# EAGLE schematic PCB 1.5 TH (EAGLE 6.5.0)
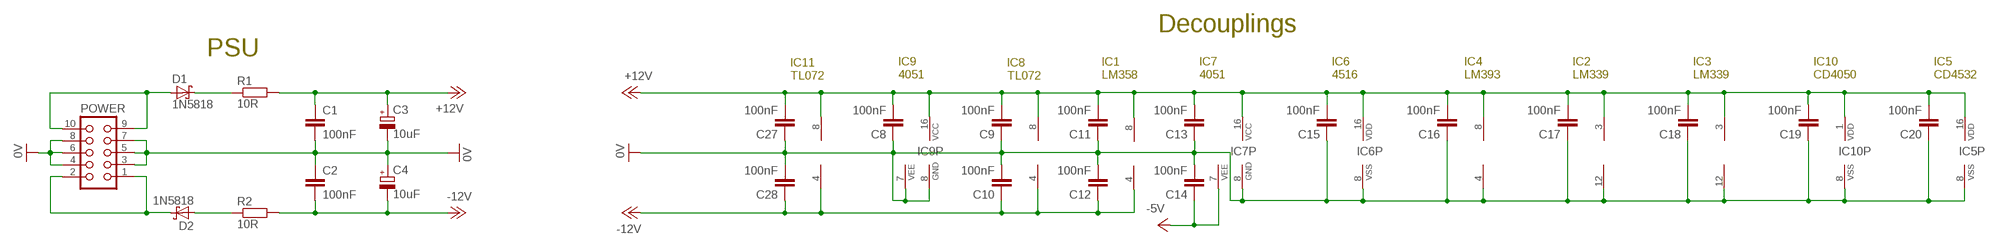
[diagram p0: schematic, sheet 1, part 1 of 2]
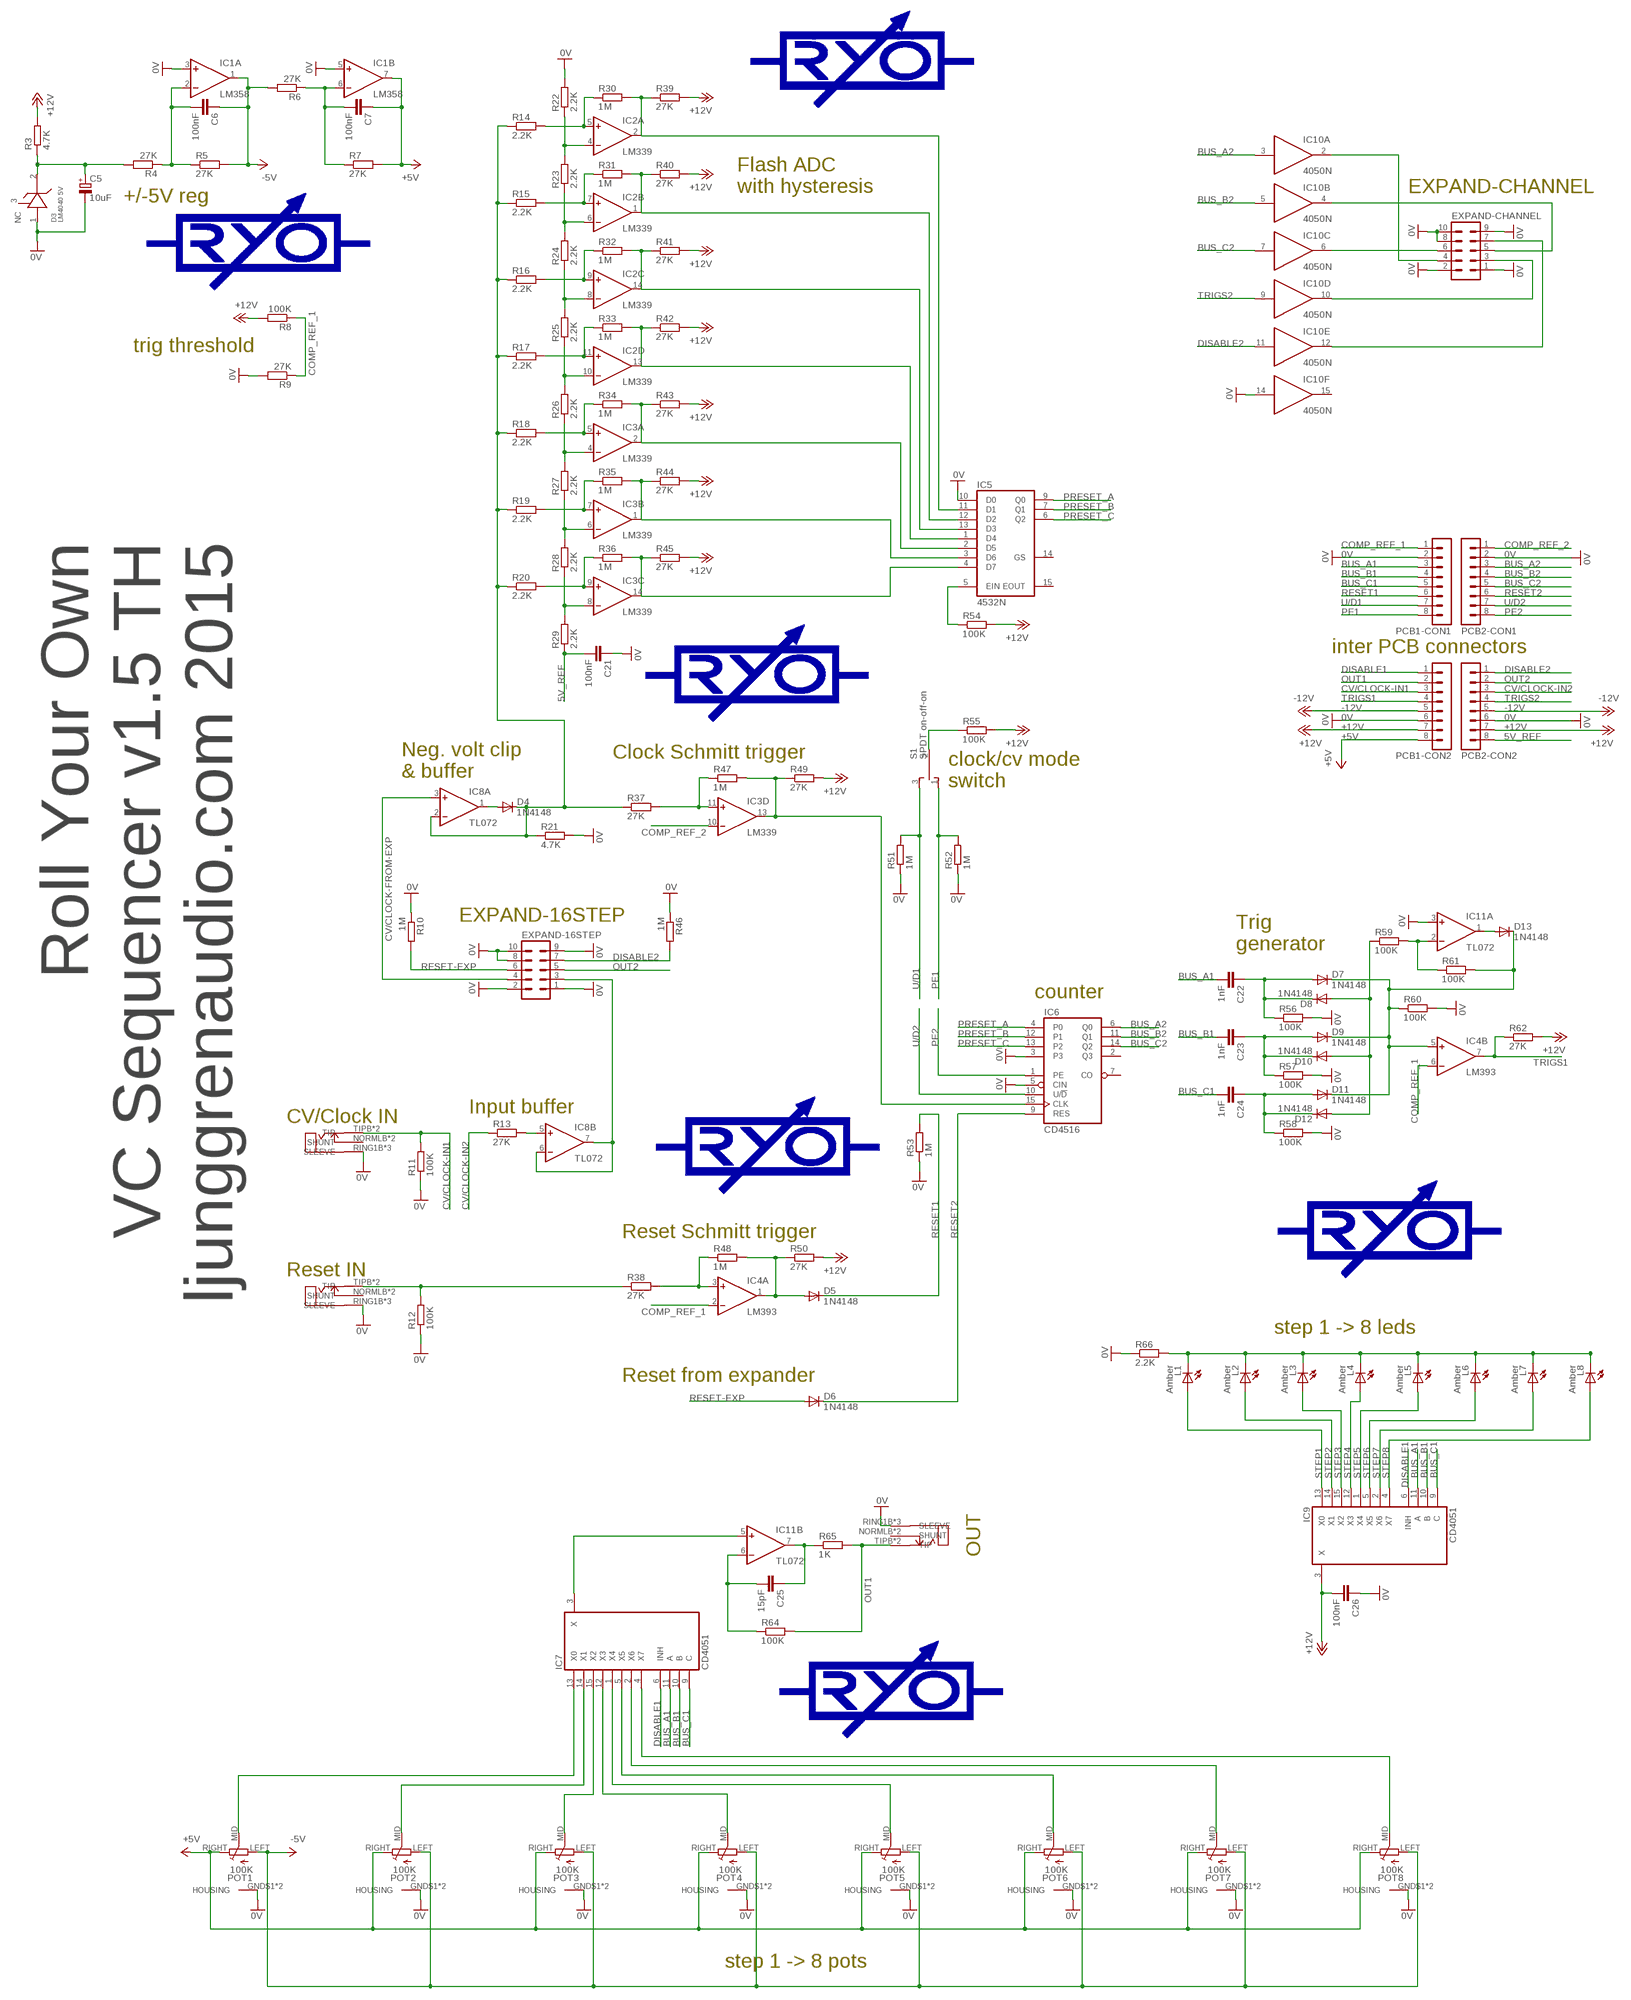
[diagram p1: schematic, sheet 1, part 2 of 2]

## Parts
C1  100nF  C-EU025-024X044  [C025-024X044]
C2  100nF  C-EU025-024X044  [C025-024X044]
C3  10uF  CPOL-EUE2-5  [E2-5]
C4  10uF  CPOL-EUE2-5  [E2-5]
C5  10uF  CPOL-EUE2-5  [E2-5]
C6  100nF  C-EU025-024X044  [C025-024X044]
C7  100nF  C-EU025-024X044  [C025-024X044]
C8  100nF  C-EU025-024X044  [C025-024X044]
C9  100nF  C-EU025-024X044  [C025-024X044]
C10  100nF  C-EU025-024X044  [C025-024X044]
C11  100nF  C-EU025-024X044  [C025-024X044]
C12  100nF  C-EU025-024X044  [C025-024X044]
C13  100nF  C-EU025-024X044  [C025-024X044]
C14  100nF  C-EU025-024X044  [C025-024X044]
C15  100nF  C-EU025-024X044  [C025-024X044]
C16  100nF  C-EU025-024X044  [C025-024X044]
C17  100nF  C-EU025-024X044  [C025-024X044]
C18  100nF  C-EU025-024X044  [C025-024X044]
C19  100nF  C-EU025-024X044  [C025-024X044]
C20  100nF  C-EU025-024X044  [C025-024X044]
C21  100nF  C-EU025-024X044  [C025-024X044]
C22  1nF  C-EU025-024X044  [C025-024X044]
C23  1nF  C-EU025-024X044  [C025-024X044]
C24  1nF  C-EU025-024X044  [C025-024X044]
C25  15pF  C-EU025-024X044  [C025-024X044]
C26  100nF  C-EU025-024X044  [C025-024X044]
C27  100nF  C-EU025-024X044  [C025-024X044]
C28  100nF  C-EU025-024X044  [C025-024X044]
CV/CLK-IN  ERTHENVAR_3.5MM_JACKSLOTS  [ERTHENVAR-SLOTS]
D1  1N5818  SB130DO-204AL  [DO41-7]
D2  1N5818  SB130DO-204AL  [DO41-7]
D3  LM4040 5V  LM4040  [TO92-LINE]
D4  1N4148  1N4148DO35-6  [DO35-6]
D5  1N4148  1N4148DO35-6  [DO35-6]
D6  1N4148  1N4148DO35-6  [DO35-6]
D7  1N4148  1N4148DO35-6  [DO35-6]
D8  1N4148  1N4148DO35-6  [DO35-6]
D9  1N4148  1N4148DO35-6  [DO35-6]
D10  1N4148  1N4148DO35-6  [DO35-6]
D11  1N4148  1N4148DO35-6  [DO35-6]
D12  1N4148  1N4148DO35-6  [DO35-6]
D13  1N4148  1N4148DO35-6  [DO35-6]
EXPAND-16STEP  MA05-2  [MA05-2]
EXPAND-CHANNEL  MA05-2  [MA05-2]
IC1  LM358  LM358N  [DIL08]
IC2  LM339  LM2901N  [DIL14]
IC3  LM339  LM2901N  [DIL14]
IC4  LM393  LM2903N  [DIL08]
IC5  4532N  [DIL16]
IC6  CD4516  4516N  [DIL16]
IC7  CD4051  4051N  [DIL16]
IC8  TL072  TL072P  [DIL08]
IC9  CD4051  4051N  [DIL16]
IC10  4050N  [DIL16]
IC11  TL072  TL072P  [DIL08]
L1  Amber  LED3MM  [LED3MM]
L2  Amber  LED3MM  [LED3MM]
L3  Amber  LED3MM  [LED3MM]
L4  Amber  LED3MM  [LED3MM]
L5  Amber  LED3MM  [LED3MM]
L6  Amber  LED3MM  [LED3MM]
L7  Amber  LED3MM  [LED3MM]
L8  Amber  LED3MM  [LED3MM]
OUT  ERTHENVAR_3.5MM_JACKSLOTS  [ERTHENVAR-SLOTS]
PCB1-CON1  MA08-1  [MA08-1]
PCB1-CON2  MA08-1  [MA08-1]
PCB2-CON1  MA08-1  [MA08-1]
PCB2-CON2  MA08-1  [MA08-1]
POT1  100K  POT-ALPHA9  [POT-ALPHA9]
POT2  100K  POT-ALPHA9  [POT-ALPHA9]
POT3  100K  POT-ALPHA9  [POT-ALPHA9]
POT4  100K  POT-ALPHA9  [POT-ALPHA9]
POT5  100K  POT-ALPHA9  [POT-ALPHA9]
POT6  100K  POT-ALPHA9  [POT-ALPHA9]
POT7  100K  POT-ALPHA9  [POT-ALPHA9]
POT8  100K  POT-ALPHA9  [POT-ALPHA9]
POWER  CON10L  [CON10L]
R1  10R  R-EU_0207/10  [0207/9]
R2  10R  R-EU_0207/10  [0207/9]
R3  4.7K  R-EU_0207/10  [0207/9]
R4  27K  R-EU_0207/10  [0207/9]
R5  27K  R-EU_0207/10  [0207/9]
R6  27K  R-EU_0207/10  [0207/9]
R7  27K  R-EU_0207/10  [0207/9]
R8  100K  R-EU_0207/10  [0207/9]
R9  27K  R-EU_0207/10  [0207/9]
R10  1M  R-EU_0207/10  [0207/9]
R11  100K  R-EU_0207/10  [0207/9]
R12  100K  R-EU_0207/10  [0207/9]
R13  27K  R-EU_0207/10  [0207/9]
R14  2.2K  R-EU_0207/10  [0207/9]
R15  2.2K  R-EU_0207/10  [0207/9]
R16  2.2K  R-EU_0207/10  [0207/9]
R17  2.2K  R-EU_0207/10  [0207/9]
R18  2.2K  R-EU_0207/10  [0207/9]
R19  2.2K  R-EU_0207/10  [0207/9]
R20  2.2K  R-EU_0207/10  [0207/9]
R21  4.7K  R-EU_0207/10  [0207/9]
R22  2.2K  R-EU_0207/10  [0207/9]
R23  2.2K  R-EU_0207/10  [0207/9]
R24  2.2K  R-EU_0207/10  [0207/9]
R25  2.2K  R-EU_0207/10  [0207/9]
R26  2.2K  R-EU_0207/10  [0207/9]
R27  2.2K  R-EU_0207/10  [0207/9]
R28  2.2K  R-EU_0207/10  [0207/9]
R29  2.2K  R-EU_0207/10  [0207/9]
R30  1M  R-EU_0207/10  [0207/9]
R31  1M  R-EU_0207/10  [0207/9]
R32  1M  R-EU_0207/10  [0207/9]
R33  1M  R-EU_0207/10  [0207/9]
R34  1M  R-EU_0207/10  [0207/9]
R35  1M  R-EU_0207/10  [0207/9]
R36  1M  R-EU_0207/10  [0207/9]
R37  27K  R-EU_0207/10  [0207/9]
R38  27K  R-EU_0207/10  [0207/9]
R39  27K  R-EU_0207/10  [0207/9]
R40  27K  R-EU_0207/10  [0207/9]
R41  27K  R-EU_0207/10  [0207/9]
R42  27K  R-EU_0207/10  [0207/9]
R43  27K  R-EU_0207/10  [0207/9]
R44  27K  R-EU_0207/10  [0207/9]
R45  27K  R-EU_0207/10  [0207/9]
R46  1M  R-EU_0207/10  [0207/9]
R47  1M  R-EU_0207/10  [0207/9]
R48  1M  R-EU_0207/10  [0207/9]
R49  27K  R-EU_0207/10  [0207/9]
R50  27K  R-EU_0207/10  [0207/9]
R51  1M  R-EU_0207/10  [0207/9]
R52  1M  R-EU_0207/10  [0207/9]
R53  1M  R-EU_0207/10  [0207/9]
R54  100K  R-EU_0207/10  [0207/9]
R55  100K  R-EU_0207/10  [0207/9]
R56  100K  R-EU_0207/10  [0207/9]
R57  100K  R-EU_0207/10  [0207/9]
R58  100K  R-EU_0207/10  [0207/9]
R59  100K  R-EU_0207/10  [0207/9]
R60  100K  R-EU_0207/10  [0207/9]
R61  100K  R-EU_0207/10  [0207/9]
R62  27K  R-EU_0207/10  [0207/9]
R64  100K  R-EU_0207/10  [0207/9]
R65  1K  R-EU_0207/10  [0207/9]
R66  2.2K  R-EU_0207/10  [0207/9]
R-IN  ERTHENVAR_3.5MM_JACKSLOTS  [ERTHENVAR-SLOTS]
S1  SPDT on-off-on  SPDTTOP-SUBMINI  [SPDT-HORIZONTAL-TOP-SUBMINI-MULTICOMP]

## Nets
0V: C1.2 C2.1 C3.- C4.+ C5.- C8.1 C9.1 C10.2 C11.1 C12.2 C13.1 C14.2 C15.1 C16.1 C17.1 C18.1 C19.1 C20.1 C21.1 C26.1 C27.1 C28.2 CV/CLK-IN.RING1B(SLEEVE) CV/CLK-IN.RING1T(SLEEVE) CV/CLK-IN.RING2H(SLEEVE) D3.1(-) EXPAND-16STEP.1 EXPAND-16STEP.2 EXPAND-16STEP.8 EXPAND-16STEP.9 EXPAND-16STEP.10 EXPAND-CHANNEL.1 EXPAND-CHANNEL.2 EXPAND-CHANNEL.8 EXPAND-CHANNEL.9 EXPAND-CHANNEL.10 IC1.3(A:+IN) IC1.5(B:+IN) IC2.12(P:V-) IC3.12(P:V-) IC4.4(P:V-) IC5.8(VSS) IC5.10(D0) IC6.3 IC6.5(CIN) IC6.8(VSS) IC7.8(GND) IC9.7(VEE) IC9.8(GND) IC10.8(P:VSS) IC10.14(F:I) IC11.3(A:+IN) OUT.RING1B(SLEEVE) OUT.RING1T(SLEEVE) OUT.RING2H(SLEEVE) PCB1-CON1.2 PCB1-CON2.6 PCB2-CON1.2 PCB2-CON2.6 POT1.GND$1(HOUSING) POT1.GND$2(HOUSING) POT2.GND$1(HOUSING) POT2.GND$2(HOUSING) POT3.GND$1(HOUSING) POT3.GND$2(HOUSING) POT4.GND$1(HOUSING) POT4.GND$2(HOUSING) POT5.GND$1(HOUSING) POT5.GND$2(HOUSING) POT6.GND$1(HOUSING) POT6.GND$2(HOUSING) POT7.GND$1(HOUSING) POT7.GND$2(HOUSING) POT8.GND$1(HOUSING) POT8.GND$2(HOUSING) POWER.3 POWER.4 POWER.5 POWER.6 POWER.7 POWER.8 R9.2 R10.1 R11.1 R12.1 R21.2 R22.2 R46.1 R51.1 R52.1 R53.1 R56.2 R57.2 R58.2 R60.2 R66.1 R-IN.RING1B(SLEEVE) R-IN.RING1T(SLEEVE) R-IN.RING2H(SLEEVE)
5V_REF: C21.2 PCB2-CON2.8 R29.1
+5V: C7.1 IC1.7(B:OUT) PCB1-CON2.8 POT1.RIGHT POT2.RIGHT POT3.RIGHT POT4.RIGHT POT5.RIGHT POT6.RIGHT POT7.RIGHT POT8.RIGHT R7.2
+12V: C1.1 C3.+ C8.2 C9.2 C11.2 C13.2 C15.2 C16.2 C17.2 C18.2 C19.2 C20.2 C26.2 C27.2 IC1.8(P:V+) IC2.3(P:V+) IC3.3(P:V+) IC4.8(P:V+) IC5.16(VDD) IC6.16(VDD) IC7.16(VCC) IC8.8(P:V+) IC9.3(X) IC9.16(VCC) IC10.1(P:VDD) IC11.8(P:V+) PCB1-CON2.7 PCB2-CON2.7 R1.2 R3.2 R8.2 R39.2 R40.2 R41.2 R42.2 R43.2 R44.2 R45.2 R49.2 R50.2 R54.2 R55.2 R62.2
-5V: C6.1 C14.1 IC1.1(A:OUT) IC7.7(VEE) POT1.LEFT POT2.LEFT POT3.LEFT POT4.LEFT POT5.LEFT POT6.LEFT POT7.LEFT POT8.LEFT R5.2 R6.2
-12V: C2.2 C4.- C10.1 C12.1 C28.1 IC1.4(P:V-) IC8.4(P:V-) IC11.4(P:V-) PCB1-CON2.5 PCB2-CON2.5 R2.2
BUS_A1: C22.2 IC7.11(A) IC9.11(A) PCB1-CON1.3
BUS_A2: IC6.6(Q0) IC10.3(A:I) PCB2-CON1.3
BUS_B1: C23.2 IC7.10(B) IC9.10(B) PCB1-CON1.4
BUS_B2: IC6.11(Q1) IC10.5(B:I) PCB2-CON1.4
BUS_C1: C24.2 IC7.9(C) IC9.9(C) PCB1-CON1.5
BUS_C2: IC6.14(Q2) IC10.7(C:I) PCB2-CON1.5
COMP_REF_1: IC4.2(A:-IN) IC4.6(B:-IN) PCB1-CON1.1 R8.1 R9.1
COMP_REF_2: IC3.10(D:-IN) PCB2-CON1.1
CV/CLK-IN: EXPAND-16STEP.3 IC8.6(B:-IN) IC8.7(B:OUT)
CV/CLOCK-FROM-EXP: EXPAND-16STEP.4 IC8.3(A:+IN)
CV/CLOCK-IN1: CV/CLK-IN.TIPB(TIP) CV/CLK-IN.TIPT(TIP) PCB1-CON2.3 R11.2
CV/CLOCK-IN2: PCB2-CON2.3 R13.1
DISABLE1: IC7.6(INH) IC9.6(INH) PCB1-CON2.1
DISABLE2: EXPAND-16STEP.7 IC10.11(E:I) PCB2-CON2.1 R46.2
N$1: D4.CATHODE(C) IC8.2(A:-IN) R14.1 R15.1 R16.1 R17.1 R18.1 R19.1 R20.1 R21.1 R37.1
N$3: C25.2 IC11.6(B:-IN) R64.1
N$4: R12.2 R38.1 R-IN.TIPB(TIP) R-IN.TIPT(TIP)
N$5: D4.ANODE(A) IC8.1(A:OUT)
N$6: C7.2 IC1.6(B:-IN) R6.1 R7.1
N$7: IC8.5(B:+IN) R13.2
N$8: IC3.11(D:+IN) R37.2 R47.1
N$11: D8.ANODE(A) D10.ANODE(A) D12.ANODE(A) R59.1
N$12: IC4.3(A:+IN) R38.2 R48.1
N$13: IC5.5(EIN) R54.1
N$14: D5.ANODE(A) IC4.1(A:OUT) R48.2 R50.1
N$15: L1.K(C) L2.K(C) L3.K(C) L4.K(C) L5.K(C) L6.K(C) L7.K(C) L8.K(C) R66.2
N$16: IC2.2(A:OUT) IC5.11(D1) R30.2 R39.1
N$17: IC3.13(D:OUT) IC6.15(CLK) R47.2 R49.1
N$18: IC7.4(X7) POT8.MID
N$19: IC7.2(X6) POT7.MID
N$20: IC7.5(X5) POT6.MID
N$21: IC7.1(X4) POT5.MID
N$22: IC7.12(X3) POT4.MID
N$23: IC7.15(X2) POT3.MID
N$24: IC7.14(X1) POT2.MID
N$25: IC7.13(X0) POT1.MID
N$26: IC2.5(A:+IN) R14.2 R30.1
N$27: D1.A POWER.9 POWER.10
N$28: D1.C R1.1
N$29: D2.A R2.1
N$30: R55.1 S1.2
N$31: C6.2 IC1.2(A:-IN) R4.1 R5.1
N$33: D2.C POWER.1 POWER.2
N$35: IC2.4(A:-IN) R22.1 R23.2
N$36: IC2.1(B:OUT) IC5.12(D2) R31.2 R40.1
N$37: IC2.7(B:+IN) R15.2 R31.1
N$38: IC2.6(B:-IN) R23.1 R24.2
N$39: C5.+ D3.2(+) R3.1 R4.2
N$40: IC2.14(C:OUT) IC5.13(D3) R32.2 R41.1
N$41: IC2.9(C:+IN) R16.2 R32.1
N$42: IC7.3(X) IC11.5(B:+IN)
N$43: C22.1 D7.ANODE(A) D8.CATHODE(C) R56.1
N$44: IC2.8(C:-IN) R24.1 R25.2
N$45: IC2.13(D:OUT) IC5.1(D4) R33.2 R42.1
N$46: IC2.11(D:+IN) R17.2 R33.1
N$47: IC2.10(D:-IN) R25.1 R26.2
N$48: C23.1 D9.ANODE(A) D10.CATHODE(C) R57.1
N$49: IC3.2(A:OUT) IC5.2(D5) R34.2 R43.1
N$50: IC3.5(A:+IN) R18.2 R34.1
N$51: IC3.4(A:-IN) R26.1 R27.2
N$52: C24.1 D11.ANODE(A) D12.CATHODE(C) R58.1
N$53: IC3.1(B:OUT) IC5.3(D6) R35.2 R44.1
N$54: IC3.7(B:+IN) R19.2 R35.1
N$55: D13.ANODE(A) IC11.1(A:OUT)
N$56: IC3.6(B:-IN) R27.1 R28.2
N$57: IC3.14(C:OUT) IC5.4(D7) R36.2 R45.1
N$58: IC3.9(C:+IN) R20.2 R36.1
N$59: IC3.8(C:-IN) R28.1 R29.2
N$60: IC11.2(A:-IN) R59.2 R61.1
N$61: D7.CATHODE(C) D9.CATHODE(C) D11.CATHODE(C) D13.CATHODE(C) IC4.5(B:+IN) R60.1 R61.2
N$62: EXPAND-CHANNEL.4 IC10.2(A:O)
N$63: EXPAND-CHANNEL.6 IC10.6(C:O)
N$64: EXPAND-CHANNEL.5 IC10.4(B:O)
N$65: EXPAND-CHANNEL.3 IC10.10(D:O)
N$66: EXPAND-CHANNEL.7 IC10.12(E:O)
N$93: C25.1 IC11.7(B:OUT) R65.1
OUT1: OUT.TIPB(TIP) OUT.TIPT(TIP) PCB1-CON2.2 R64.2 R65.2
OUT2: EXPAND-16STEP.5 PCB2-CON2.2
PE1: PCB1-CON1.8 R52.2 S1.1
PE2: IC6.1(PE) PCB2-CON1.8
PRESET_A: IC5.9(Q0) IC6.4(P0)
PRESET_B: IC5.7(Q1) IC6.12(P1)
PRESET_C: IC5.6(Q2) IC6.13(P2)
RESET1: D5.CATHODE(C) PCB1-CON1.6 R53.2
RESET2: D6.CATHODE(C) IC6.9(RES) PCB2-CON1.6
RESET-EXP: D6.ANODE(A) EXPAND-16STEP.6 R10.2
STEP1: IC9.13(X0) L1.A
STEP2: IC9.14(X1) L2.A
STEP3: IC9.15(X2) L3.A
STEP4: IC9.12(X3) L4.A
STEP5: IC9.1(X4) L5.A
STEP6: IC9.5(X5) L6.A
STEP7: IC9.2(X6) L7.A
STEP8: IC9.4(X7) L8.A
TRIGS1: IC4.7(B:OUT) PCB1-CON2.4 R62.1
TRIGS2: IC10.9(D:I) PCB2-CON2.4
U/D1: PCB1-CON1.7 R51.2 S1.3
U/D2: IC6.10(U/!D) PCB2-CON1.7
Unconnected: CV/CLK-IN.NORMLB(SHUNT) CV/CLK-IN.NORMLT(SHUNT) D3.3(NC) IC5.14(GS) IC5.15(EOUT) IC6.2(Q3) IC6.7(CO) IC10.15(F:O) OUT.NORMLB(SHUNT) OUT.NORMLT(SHUNT) R-IN.NORMLB(SHUNT) R-IN.NORMLT(SHUNT)

## Notes on the sheet
- Decouplings
- PSU
- IC9
  4051
- IC7
  4051
- IC6
  4516
- IC4
  LM393
- IC2
  LM339
- IC3
  LM339
- IC10
  CD4050
- IC5
  CD4532
- IC1
  LM358
- IC11
  TL072
- IC8
  TL072
- Flash ADC
  with hysteresis
- EXPAND-CHANNEL
- +/-5V reg
- trig threshold
- Roll Your Own
  VC Sequencer v1.5 TH
  ljunggrenaudio.com 2015
- inter PCB connectors
- Clock Schmitt trigger
- Neg. volt clip
  & buffer
- clock/cv mode
  switch
- EXPAND-16STEP
- Trig
  generator
- counter
- Input buffer
- CV/Clock IN
- Reset Schmitt trigger
- Reset IN
- step 1 -> 8 leds
- Reset from expander
- OUT
- step 1 -> 8 pots

## Library data of the parts
C1 C2 C6-C28 = Roll Your Own:C-EU: CAPACITOR, European symbol
C3-C5 = Roll Your Own:CPOL-EU: POLARIZED CAPACITOR, European symbol
CV/CLK-IN OUT R-IN = Roll Your Own:ERTHENVAR_3.5MM_JACK
D1 D2 = Roll Your Own:SB130
D3 = Roll Your Own:LM4040
D4-D13 = Roll Your Own:1N4148: DIODE high speed (Philips)
EXPAND-16STEP EXPAND-CHANNEL = Roll Your Own:MA05-2: PIN HEADER; OC_FARNELL: unknown; OC_NEWARK: unknown
IC1 = Roll Your Own:LM358: OP AMP also LM158; LM258; LM2904 Source: http://cache.national.com/ds/LM/LM158.pdf
IC2 IC3 = Roll Your Own:LM2901: COMPARATOR
IC4 = Roll Your Own:LM2903: COMPARATOR
IC5 = Roll Your Own:4532: 8-bit PRIORITY ENCODER
IC6 = Roll Your Own:4516: Binary up down COUNTER
IC7 IC9 = Roll Your Own:4051: 8-channel ANALOG MULTIPLEXER
IC8 IC11 = Roll Your Own:TL072: OP AMP
IC10 = Roll Your Own:4050: Hex non-inverting BUFFER
L1-L8 = Roll Your Own:LED: LED OSRAM: - CHIPLED LG R971, LG N971, LY N971, LG Q971, LY Q971, LO R971, LY R971 LH N974, LH R974 LS Q976, LO Q976, LY Q976 LO Q996 - Hyper CHIPLED LW Q18S LB Q993, LB Q99A, LB R99A - SideLED LS A670, LO A670, LY A670, LG A670, LP A670 LB A673, LV A673, LT A673, LW A673 LH A674 LY A675 LS A676, LA A676, LO A676, LY A676, LW A676 LS A679, LY A679, LG A679 - Hyper Micro SIDELED® LS Y876, LA Y876, LO Y876, LY Y876 LT Y87S - SmartLED LW L88C, LW L88S LB L89C, LB L89S, LG L890 LS L89K, LO L89K, LY L89K LS L896, LA L896, LO L896, LY L896 - TOPLED LS T670, LO T670, LY T670, LG T670, LP T670 LSG T670, LSP T670, LSY T670, LOP T670, LYG T670 LG T671, LOG T671, LSG T671 LB T673, LV T673, LT T673, LW T673 LH T674 LS T676, LA T676, LO T676, LY T676, LB T676, LH T676, LSB T676, LW T676 LB T67C, LV T67C, LT T67C, LS T67K, LO T67K, LY T67K, LW E67C LS E67B, LA E67B, LO E67B, LY E67B, LB E67C, LV E67C, LT E67C LW T67C LS T679, LY T679, LG T679 LS T770, LO T770, LY T770, LG T770, LP T770 LB T773, LV T773, LT T773, LW T773 LH T774 LS E675, LA E675, LY E675, LS T675 LS T776, LA T776, LO T776, LY T776, LB T776 LHGB T686 LT T68C, LB T68C - Hyper Mini TOPLED® LB M676 - Mini TOPLED Santana® LG M470 LS M47K, LO M47K, LY M47K Source: http://www.osram.convergy.de LUXEON: - LUMILED® LXK2-PW12-R00, LXK2-PW12-S00, LXK2-PW14-U00, LXK2-PW14-V00 LXK2-PM12-R00, LXK2-PM12-S00, LXK2-PM14-U00 LXK2-PE12-Q00, LXK2-PE12-R00, LXK2-PE12-S00, LXK2-PE14-T00, LXK2-PE14-U00 LXK2-PB12-K00, LXK2-PB12-L00, LXK2-PB12-M00, LXK2-PB14-N00, LXK2-PB14-P00, LXK2-PB14-Q00 LXK2-PR12-L00, LXK2-PR12-M00, LXK2-PR14-Q00, LXK2-PR14-R00 LXK2-PD12-Q00, LXK2-PD12-R00, LXK2-PD12-S00 LXK2-PH12-R00, LXK2-PH12-S00 LXK2-PL12-P00, LXK2-PL12-Q00, LXK2-PL12-R00 Source: www.luxeon.com KINGBRIGHT: KA-3528ASYC Source: www.kingbright.com
PCB1-CON1 PCB1-CON2 PCB2-CON1 PCB2-CON2 = Roll Your Own:MA08-1: PIN HEADER; OC_FARNELL: unknown; OC_NEWARK: unknown
POT1-POT8 = Roll Your Own:POT-ALPHA9
POWER = Roll Your Own:CON10L: CONNECTOR; OC_FARNELL: unknown; OC_NEWARK: unknown
R1-R62 R64-R66 = Roll Your Own:R-EU_: RESISTOR, European symbol
S1 = Roll Your Own:SPDT: Horizontal SPDT switch in the center-off position.